# Altium project controller.PrjPcb
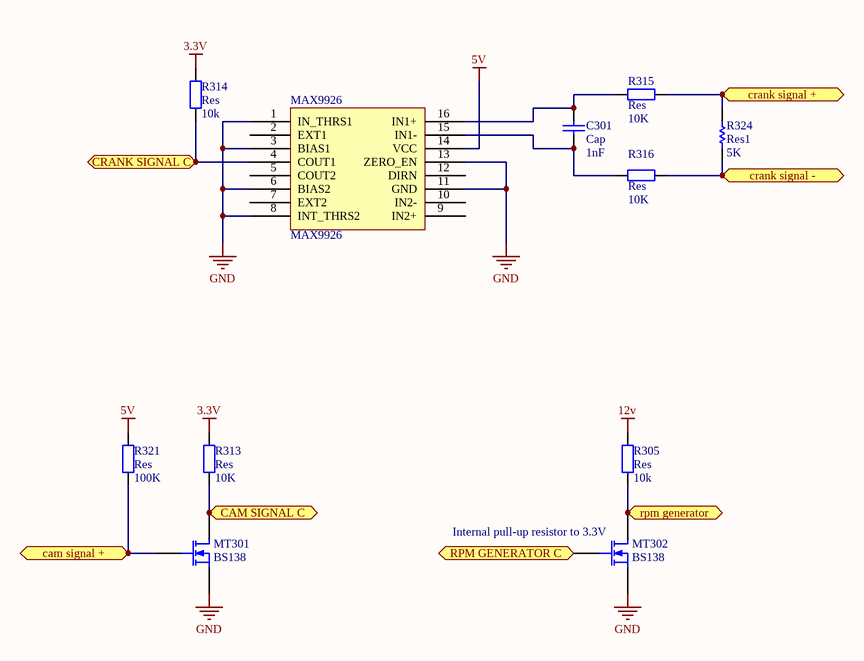
[diagram p0: tach.SchDoc]
7 sheets, 105 parts. Net scope: global (net labels, ports and power ports of the same name join across sheets).
Board file: controller.PcbDoc
Sheets:
  tach.SchDoc
  controller.SchDoc
  power.SchDoc
  ignition.SchDoc
  connectors.SchDoc
  analogSignals.SchDoc
  injectors.SchDoc

## Sheet tach.SchDoc
size A4

### Parts
C301  Cap  value 1nF  [1206 footprint]
MAX9926  MAX9926  [TSSOP-16]
MT301  BS138  [SOT23]
MT302  BS138  [SOT23]
R305  Res  value 10k  [1206 footprint]
R313  Res  value 10K  [1206 footprint]
R314  Res  value 10k  [1206 footprint]
R315  Res  value 10K  [1206 footprint]
R316  Res  value 10K  [1206 footprint]
R321  Res  value 100K  [1206 footprint]
R324  Res1  value 5K  [AXIAL-0.3]

### Ports
cam signal + (bidir), CAM SIGNAL C (bidir), crank signal + (bidir), crank signal - (bidir), CRANK SIGNAL C (bidir), rpm generator (bidir), RPM GENERATOR C (bidir)

### Nets
3.3V: R313.2 R314.2
5V: MAX9926.14(VCC) R321.2
12V: R305.2
GND: MAX9926.1(IN_THRS1) MAX9926.3(BIAS1) MAX9926.6(BIAS2) MAX9926.8(INT_THRS2) MAX9926.11(GND) MAX9926.13(ZERO_EN) MT301.2(S) MT302.2(S)
NetArduino_Due_Core_54: MAX9926.4(COUT1) R314.1 ; port CRANK SIGNAL C
NetArduino_Due_Core_58: MT301.3(D) R313.1 ; port CAM SIGNAL C
NetArduino_Due_Core_91: MT302.1(G) ; port RPM GENERATOR C
NetATX*_4: R315.2 R324.2 ; port crank signal +
NetATX*_5: MT301.1(G) R321.1 ; port cam signal +
NetATX*_16: R316.2 R324.1 ; port crank signal -
NetATX*_17: MT302.3(D) R305.1 ; port rpm generator
NetC301_1: C301.1 MAX9926.15(IN1-) R316.1
NetC301_2: C301.2 MAX9926.16(IN1+) R315.1

Not connected (* = marked no-connect by the designer): MAX9926 2(EXT1) 5(COUT2) 7(EXT2) 9(IN2+) 10(IN2-) 12(DIRN)

### Notes on the sheet
- (near MT302) Internal pull-up resistor to 3.3V

### Library data of the parts
R324 = Res1: Resistor; Published: 8-Jun-2000; LatestRevisionDate: 17-Jul-2002; LatestRevisionNote: Re-released for DXP Platform.; PackageReference: AXIAL-0.3; Publisher: Altium Limited; PackageDescription: Axial Device, Thru-Hole; 2 Leads; 0.3 in Pin Spacing

## Sheet controller.SchDoc
size A4
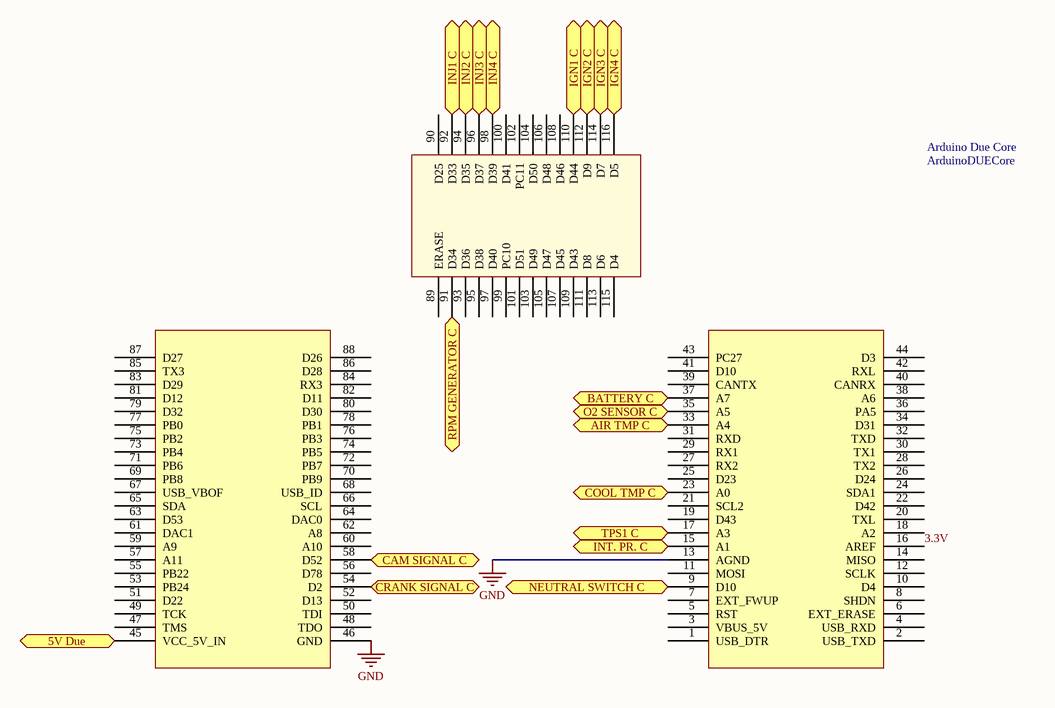
[diagram p1: controller.SchDoc]

### Parts
Arduino_Due_Core  ArduinoDUECore  [ARDUINO DUE CORE]

### Ports
5V Due (bidir), AIR TMP C (bidir), BATTERY C (bidir), CAM SIGNAL C (bidir), COOL TMP C (bidir), CRANK SIGNAL C (bidir), IGN1 C (bidir), IGN2 C (bidir), IGN3 C (bidir), IGN4 C (bidir), INJ1 C (bidir), INJ2 C (bidir), INJ3 C (bidir), INJ4 C (bidir), INT. PR. C (bidir), NEUTRAL SWITCH C (bidir), O2 SENSOR C (bidir), RPM GENERATOR C (bidir), TPS1 C (bidir)

### Nets
3.3V: Arduino_Due_Core.16(AREF)
GND: Arduino_Due_Core.13(AGND) Arduino_Due_Core.46(GND)
NetArduino_Due_Core_9: Arduino_Due_Core.9(D10) ; port NEUTRAL SWITCH C
NetArduino_Due_Core_15: Arduino_Due_Core.15(A1) ; port INT. PR. C
NetArduino_Due_Core_17: Arduino_Due_Core.17(A3) ; port TPS1 C
NetArduino_Due_Core_23: Arduino_Due_Core.23(A0) ; port COOL TMP C
NetArduino_Due_Core_33: Arduino_Due_Core.33(A4) ; port AIR TMP C
NetArduino_Due_Core_35: Arduino_Due_Core.35(A5) ; port O2 SENSOR C
NetArduino_Due_Core_37: Arduino_Due_Core.37(A7) ; port BATTERY C
NetArduino_Due_Core_45: Arduino_Due_Core.45(VCC_5V_IN) ; port 5V Due
NetArduino_Due_Core_54: Arduino_Due_Core.54(D2) ; port CRANK SIGNAL C
NetArduino_Due_Core_58: Arduino_Due_Core.58(D52) ; port CAM SIGNAL C
NetArduino_Due_Core_91: Arduino_Due_Core.91(D34) ; port RPM GENERATOR C
NetArduino_Due_Core_92: Arduino_Due_Core.92(D33) ; port INJ1 C
NetArduino_Due_Core_94: Arduino_Due_Core.94(D35) ; port INJ2 C
NetArduino_Due_Core_96: Arduino_Due_Core.96(D37) ; port INJ3 C
NetArduino_Due_Core_98: Arduino_Due_Core.98(D39) ; port INJ4 C
NetArduino_Due_Core_110: Arduino_Due_Core.110(D44) ; port IGN1 C
NetArduino_Due_Core_112: Arduino_Due_Core.112(D9) ; port IGN2 C
NetArduino_Due_Core_114: Arduino_Due_Core.114(D7) ; port IGN3 C
NetArduino_Due_Core_116: Arduino_Due_Core.116(D5) ; port IGN4 C

Not connected (* = marked no-connect by the designer): Arduino_Due_Core 1(USB_DTR) 2(USB_TXD) 3(VBUS_5V) 4(USB_RXD) 5(RST) 6(EXT_ERASE) 7(EXT_FWUP) 8(SHDN) 10(D4) 11(MOSI) 12(SCLK) 14(MISO) 18(A2) 19(D43) 20(TXL) 21(SCL2) 22(D42) 24(SDA1) 25(D23) 26(D24) 27(RX2) 28(TX2) 29(RX1) 30(TX1) 31(RXD) 32(TXD) 34(D31) 36(PA5) 38(A6) 39(CANTX) 40(CANRX) 41(D10) 42(RXL) 43(PC27) 44(D3) 47(TMS) 48(TDO) 49(TCK) 50(TDI) 51(D22) 52(D13) 53(PB24) 55(PB22) 56(D78) 57(A11) 59(A9) 60(A10) 61(DAC1) 62(A8) 63(D53) 64(DAC0) 65(SDA) 66(SCL) 67(USB_VBOF) 68(USB_ID) 69(PB8) 70(PB9) 71(PB6) 72(PB7) 73(PB4) 74(PB5) 75(PB2) 76(PB3) 77(PB0) 78(PB1) 79(D32) 80(D30) 81(D12) 82(D11) 83(D29) 84(RX3) 85(TX3) 86(D28) 87(D27) 88(D26) 89(ERASE) 90(D25) 93(D36) 95(D38) 97(D40) 99(PC10) 100(D41) 101(D51) 102(PC11) 103(D49) 104(D50) 105(D47) 106(D48) 107(D45) 108(D46) 109(D43) 111(D8) 113(D6) 115(D4)

## Sheet power.SchDoc
size A4
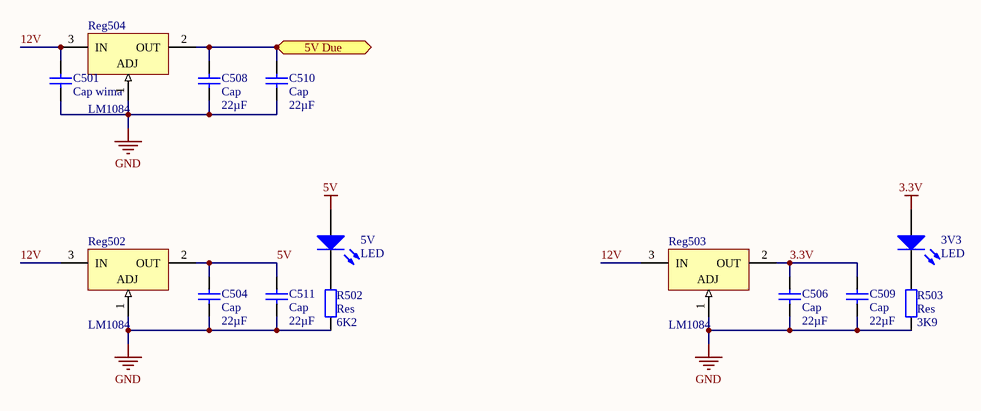
[diagram p2: power.SchDoc]

### Parts
3V3  LED  [LED 3mm]
5V  LED  [LED 3mm]
C501  Cap wima  [Wima 11x16x7.2mm]
C504  Cap  value 22µF  [1206 footprint]
C506  Cap  value 22µF  [1206 footprint]
C508  Cap  value 22µF  [1206 footprint]
C509  Cap  value 22µF  [1206 footprint]
C510  Cap  value 22µF  [1206 footprint]
C511  Cap  value 22µF  [1206 footprint]
R502  Res  value 6K2  [1206 footprint]
R503  Res  value 3K9  [1206 footprint]
Reg502  LM1084  [LM1084]
Reg503  LM1084  [LM1084]
Reg504  LM1084  [LM1084]

### Ports
5V Due (bidir)

### Nets
3.3V: 3V3.1(A) C506.2 C509.2 Reg503.2(OUT)
5V: 5V.1(A) C504.2 C511.2 Reg502.2(OUT)
12V: C501.2 Reg502.3(IN) Reg503.3(IN) Reg504.3(IN)
GND: C501.1 C504.1 C506.1 C508.1 C509.1 C510.1 C511.1 R502.1 R503.1 Reg502.1(ADJ) Reg503.1(ADJ) Reg504.1(ADJ)
Net3V3_2: 3V3.2(K) R503.2
Net5V_2: 5V.2(K) R502.2
NetArduino_Due_Core_45: C508.2 C510.2 Reg504.2(OUT) ; port 5V Due

## Sheet ignition.SchDoc
size A4
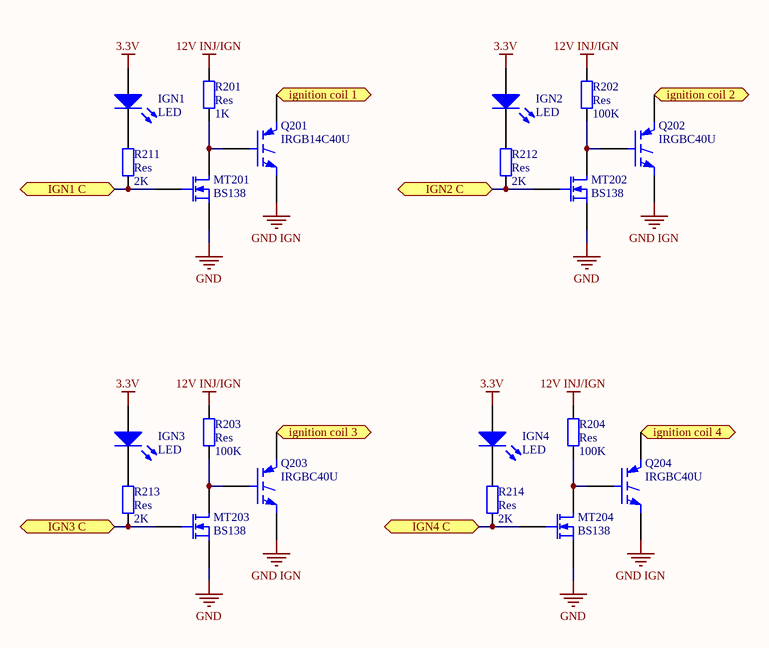
[diagram p3: ignition.SchDoc]

### Parts
IGN1  LED  [LED 3mm]
IGN2  LED  [LED 3mm]
IGN3  LED  [LED 3mm]
IGN4  LED  [LED 3mm]
MT201  BS138  [SOT23]
MT202  BS138  [SOT23]
MT203  BS138  [SOT23]
MT204  BS138  [SOT23]
Q201  IRGB14C40U  [TO-220AB]
Q202  IRGBC40U  [TO-220AB]
Q203  IRGBC40U  [TO-220AB]
Q204  IRGBC40U  [TO-220AB]
R201  Res  value 1K  [1206 footprint]
R202  Res  value 100K  [1206 footprint]
R203  Res  value 100K  [1206 footprint]
R204  Res  value 100K  [1206 footprint]
R211  Res  value 2K  [1206 footprint]
R212  Res  value 2K  [1206 footprint]
R213  Res  value 2K  [1206 footprint]
R214  Res  value 2K  [1206 footprint]

### Ports
IGN1 C (bidir), IGN2 C (bidir), IGN3 C (bidir), IGN4 C (bidir), ignition coil 1 (bidir), ignition coil 2 (bidir), ignition coil 3 (bidir), ignition coil 4 (bidir)

### Nets
3.3V: IGN1.1(A) IGN2.1(A) IGN3.1(A) IGN4.1(A)
12V INJ/IGN: R201.2 R202.2 R203.2 R204.2
GND: MT201.2(S) MT202.2(S) MT203.2(S) MT204.2(S)
GND IGN: Q201.3(E) Q202.3(E) Q203.3(E) Q204.3(E)
NetArduino_Due_Core_110: MT201.1(G) R211.1 ; port IGN1 C
NetArduino_Due_Core_112: MT202.1(G) R212.1 ; port IGN2 C
NetArduino_Due_Core_114: MT203.1(G) R213.1 ; port IGN3 C
NetArduino_Due_Core_116: MT204.1(G) R214.1 ; port IGN4 C
NetATX*_11: Q204.2(C) ; port ignition coil 4
NetATX*_12: Q203.2(C) ; port ignition coil 3
NetATX*_23: Q201.2(C) ; port ignition coil 1
NetATX*_24: Q202.2(C) ; port ignition coil 2
NetIGN1_2: IGN1.2(K) R211.2
NetIGN2_2: IGN2.2(K) R212.2
NetIGN3_2: IGN3.2(K) R213.2
NetIGN4_2: IGN4.2(K) R214.2
NetMT201_3: MT201.3(D) Q201.1(G) R201.1
NetMT202_3: MT202.3(D) Q202.1(G) R202.1
NetMT203_3: MT203.3(D) Q203.1(G) R203.1
NetMT204_3: MT204.3(D) Q204.1(G) R204.1

### Library data of the parts
Q201-Q204 = IRGBC40U: Insulated Gate Bipolar Transistor; Note: Pin 2 (collector) is electrically connected to the TAB; Published: 8-Jun-2000; LatestRevisionDate: 17-Sep-2003; LatestRevisionNote: SIM Port Mapping Fixed.; DatasheetVersion: PD-9.683A; PackageVersion: Feb-1997; PackageReference: TO-220AB; Publisher: Altium Limited; PackageDescription: TO, Thru-Hole, Vertical, Heatsink Mounted; 3 In-Line Leads; Pitch 2.54 mm; ComponentLink1Description: Manufacturer Link; ComponentLink1URL: http://www.irf.com/

## Sheet connectors.SchDoc
size A4; PageSetup: Record=PageOptions|CenterHorizontal=True|CenterVertical=True|PrintScale=1.00|XCorrection=1.00|YCorrection=1.00|PrintKind=1|BorderSize=5000000|LeftOffset=0|BottomOffset=0|Orientation=2|PaperLength=1000|PaperWidth=1000|Scale=100|PaperSource=7|PrintQuality=600|MediaType=1|DitherType=10|PrintScaleMode=1|PaperKind=A4|PaperIndex=9
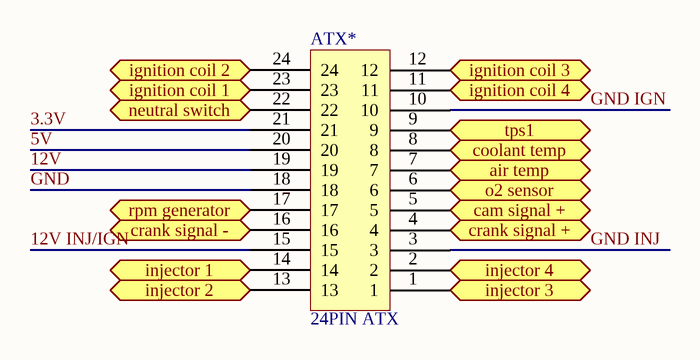
[diagram p4: connectors.SchDoc]

### Parts
ATX*  24PIN ATX  [24 PIN ATX]

### Ports
air temp (bidir), cam signal + (bidir), coolant temp (bidir), crank signal + (bidir), crank signal - (bidir), ignition coil 1 (bidir), ignition coil 2 (bidir), ignition coil 3 (bidir), ignition coil 4 (bidir), injector 1 (bidir), injector 2 (bidir), injector 3 (bidir), injector 4 (bidir), neutral switch (bidir), o2 sensor (bidir), rpm generator (bidir), tps1 (bidir)

### Nets
3.3V: ATX*.21
5V: ATX*.20
12V: ATX*.19
12V INJ/IGN: ATX*.15
GND: ATX*.18
GND IGN: ATX*.10
GND INJ: ATX*.3
NetArduino_Due_Core_9: ATX*.22 ; port neutral switch
NetATX*_1: ATX*.1 ; port injector 3
NetATX*_2: ATX*.2 ; port injector 4
NetATX*_4: ATX*.4 ; port crank signal +
NetATX*_5: ATX*.5 ; port cam signal +
NetATX*_6: ATX*.6 ; port o2 sensor
NetATX*_7: ATX*.7 ; port air temp
NetATX*_8: ATX*.8 ; port coolant temp
NetATX*_9: ATX*.9 ; port tps1
NetATX*_11: ATX*.11 ; port ignition coil 4
NetATX*_12: ATX*.12 ; port ignition coil 3
NetATX*_13: ATX*.13 ; port injector 2
NetATX*_14: ATX*.14 ; port injector 1
NetATX*_16: ATX*.16 ; port crank signal -
NetATX*_17: ATX*.17 ; port rpm generator
NetATX*_23: ATX*.23 ; port ignition coil 1
NetATX*_24: ATX*.24 ; port ignition coil 2

## Sheet analogSignals.SchDoc
size A4
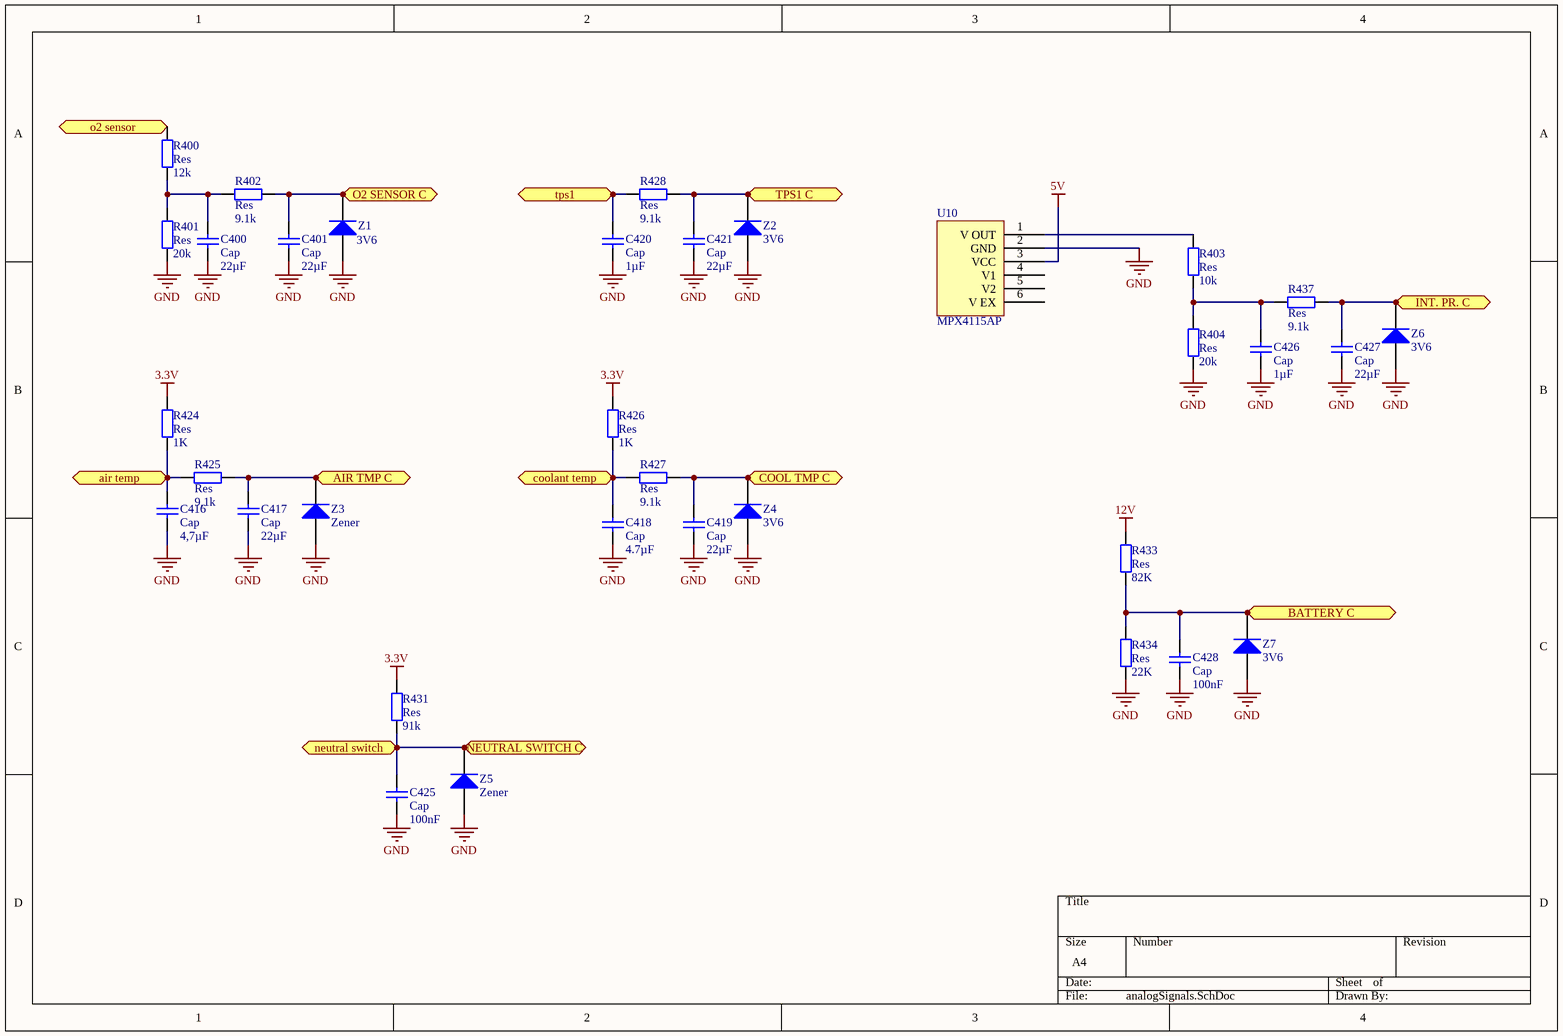
[diagram p5: analogSignals.SchDoc]

### Parts
C400  Cap  value 22µF  [1206 footprint]
C401  Cap  value 22µF  [1206 footprint]
C416  Cap  value 4,7µF  [1206 footprint]
C417  Cap  value 22µF  [1206 footprint]
C418  Cap  value 4.7µF  [1206 footprint]
C419  Cap  value 22µF  [1206 footprint]
C420  Cap  value 1µF  [1206 footprint]
C421  Cap  value 22µF  [1206 footprint]
C425  Cap  value 100nF  [1206 footprint]
C426  Cap  value 1µF  [1206 footprint]
C427  Cap  value 22µF  [1206 footprint]
C428  Cap  value 100nF  [1206 footprint]
R400  Res  value 12k  [1206 footprint]
R401  Res  value 20k  [1206 footprint]
R402  Res  value 9.1k  [1206 footprint]
R403  Res  value 10k  [1206 footprint]
R404  Res  value 20k  [1206 footprint]
R424  Res  value 1K  [1206 footprint]
R425  Res  value 9,1k  [1206 footprint]
R426  Res  value 1K  [1206 footprint]
R427  Res  value 9.1k  [1206 footprint]
R428  Res  value 9.1k  [1206 footprint]
R431  Res  value 91k  [1206 footprint]
R433  Res  value 82K  [1206 footprint]
R434  Res  value 22K  [1206 footprint]
R437  Res  value 9.1k  [1206 footprint]
U10  MPX4115AP  [MPX4115AP]
Z1  3V6  [SOD-80]
Z2  3V6  [SOD-80]
Z3  Zener  [SOD-80]
Z4  3V6  [SOD-80]
Z5  Zener  [SOD-80]
Z6  3V6  [SOD-80]
Z7  3V6  [SOD-80]

### Ports
air temp (bidir), AIR TMP C (bidir), BATTERY C (bidir), COOL TMP C (bidir), coolant temp (bidir), INT. PR. C (bidir), neutral switch (bidir), NEUTRAL SWITCH C (bidir), o2 sensor (bidir), O2 SENSOR C (bidir), tps1 (bidir), TPS1 C (bidir)

### Nets
3.3V: R424.2 R426.2 R431.2
5V: U10.3(VCC)
12V: R433.2
GND: C400.1 C401.1 C416.1 C417.1 C418.1 C419.1 C420.1 C421.1 C425.1 C426.1 C427.1 C428.1 R401.1 R404.1 R434.1 U10.2(GND) Z1.1(A) Z2.1(A) Z3.1(A) Z4.1(A) Z5.1(A) Z6.1(A) Z7.1(A)
NetArduino_Due_Core_9: C425.2 R431.1 Z5.2(K) ; port neutral switch, port NEUTRAL SWITCH C
NetArduino_Due_Core_15: C427.2 R437.2 Z6.2(K) ; port INT. PR. C
NetArduino_Due_Core_17: C421.2 R428.2 Z2.2(K) ; port TPS1 C
NetArduino_Due_Core_23: C419.2 R427.2 Z4.2(K) ; port COOL TMP C
NetArduino_Due_Core_33: C417.2 R425.2 Z3.2(K) ; port AIR TMP C
NetArduino_Due_Core_35: C401.2 R402.2 Z1.2(K) ; port O2 SENSOR C
NetArduino_Due_Core_37: C428.2 R433.1 R434.2 Z7.2(K) ; port BATTERY C
NetATX*_6: R400.2 ; port o2 sensor
NetATX*_7: C416.2 R424.1 R425.1 ; port air temp
NetATX*_8: C418.2 R426.1 R427.1 ; port coolant temp
NetATX*_9: C420.2 R428.1 ; port tps1
NetC400_2: C400.2 R400.1 R401.2 R402.1
NetC426_2: C426.2 R403.1 R404.2 R437.1
NetR403_2: R403.2 U10.1(V_OUT)

Not connected (* = marked no-connect by the designer): U10 4(V1) 5(V2) 6(V_EX)

### Library data of the parts
Z1-Z7 = TZM

## Sheet injectors.SchDoc
size A4
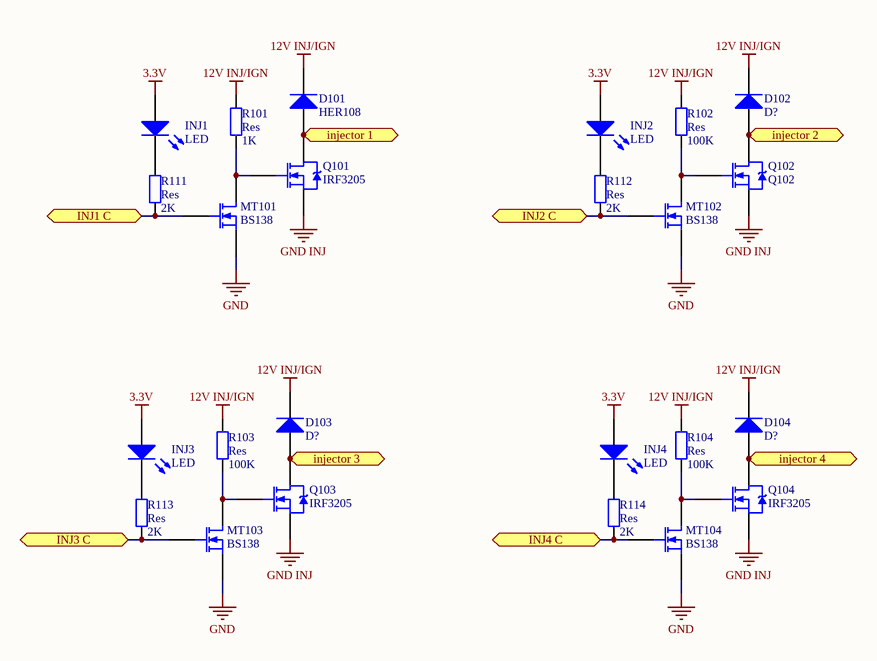
[diagram p6: injectors.SchDoc]

### Parts
D101  HER108  [1N4007]
D102  D?  [1N4007]
D103  D?  [1N4007]
D104  D?  [1N4007]
INJ1  LED  [LED 3mm]
INJ2  LED  [LED 3mm]
INJ3  LED  [LED 3mm]
INJ4  LED  [LED 3mm]
MT101  BS138  [SOT23]
MT102  BS138  [SOT23]
MT103  BS138  [SOT23]
MT104  BS138  [SOT23]
Q101  IRF3205  [TO-220AB]
Q102  Q102  [TO-220AB]
Q103  IRF3205  [TO-220AB]
Q104  IRF3205  [TO-220AB]
R101  Res  value 1K  [1206 footprint]
R102  Res  value 100K  [1206 footprint]
R103  Res  value 100K  [1206 footprint]
R104  Res  value 100K  [1206 footprint]
R111  Res  value 2K  [1206 footprint]
R112  Res  value 2K  [1206 footprint]
R113  Res  value 2K  [1206 footprint]
R114  Res  value 2K  [1206 footprint]

### Ports
INJ1 C (bidir), INJ2 C (bidir), INJ3 C (bidir), INJ4 C (bidir), injector 1 (bidir), injector 2 (bidir), injector 3 (bidir), injector 4 (bidir)

### Nets
3.3V: INJ1.1(A) INJ2.1(A) INJ3.1(A) INJ4.1(A)
12V INJ/IGN: D101.2(K) D102.2(K) D103.2(K) D104.2(K) R101.2 R102.2 R103.2 R104.2
GND: MT101.2(S) MT102.2(S) MT103.2(S) MT104.2(S)
GND INJ: Q101.3(S) Q102.3(S) Q103.3(S) Q104.3(S)
NetArduino_Due_Core_92: MT101.1(G) R111.1 ; port INJ1 C
NetArduino_Due_Core_94: MT102.1(G) R112.1 ; port INJ2 C
NetArduino_Due_Core_96: MT103.1(G) R113.1 ; port INJ3 C
NetArduino_Due_Core_98: MT104.1(G) R114.1 ; port INJ4 C
NetATX*_1: D103.1(A) Q103.2(D) ; port injector 3
NetATX*_2: D104.1(A) Q104.2(D) ; port injector 4
NetATX*_13: D102.1(A) Q102.2(D) ; port injector 2
NetATX*_14: D101.1(A) Q101.2(D) ; port injector 1
NetINJ1_2: INJ1.2(K) R111.2
NetINJ2_2: INJ2.2(K) R112.2
NetINJ3_2: INJ3.2(K) R113.2
NetINJ4_2: INJ4.2(K) R114.2
NetMT101_3: MT101.3(D) Q101.1(G) R101.1
NetMT102_3: MT102.3(D) Q102.1(G) R102.1
NetMT103_3: MT103.3(D) Q103.1(G) R103.1
NetMT104_3: MT104.3(D) Q104.1(G) R104.1

### Library data of the parts
D101-D104 = 1N4007
Q101-Q104 = IRF3205: HEXFET Power MOSFET; Note: Pin 2 is electrically connected to pin 4.; Published: 8-Jun-2000; LatestRevisionDate: 17-Jul-2002; LatestRevisionNote: Re-released for DXP Platform.; DatasheetVersion: Aug-1997; PackageVersion: Feb-1997; PackageReference: TO-220AB; Publisher: Altium Limited; PackageDescription: TO, Thru-Hole, Vertical, Heatsink Mounted; 3 In-Line Leads; Pitch 2.54 mm; ComponentLink1Description: Manufacturer Link; ComponentLink1URL: http://www.irf.com/; ComponentLink2Description: Datasheet; ComponentLink2URL: http://www.irf.com/product-info/datasheets/data/irf3205.pdf

## Nets that join several sheets
3.3V: tach (R313.2 R314.2), controller (Arduino_Due_Core.16), power (3V3.1 C506.2 C509.2 Reg503.2), ignition (IGN1.1 IGN2.1 IGN3.1 IGN4.1), connectors (ATX*.21), analogSignals (R424.2 R426.2 R431.2), injectors (INJ1.1 INJ2.1 INJ3.1 INJ4.1)
5V: tach (MAX9926.14 R321.2), power (5V.1 C504.2 C511.2 Reg502.2), connectors (ATX*.20), analogSignals (U10.3)
12V: tach (R305.2), power (C501.2 Reg502.3 Reg503.3 Reg504.3), connectors (ATX*.19), analogSignals (R433.2)
12V INJ/IGN: ignition (R201.2 R202.2 R203.2 R204.2), connectors (ATX*.15), injectors (8 pins)
GND: tach (8 pins), controller (Arduino_Due_Core.13 Arduino_Due_Core.46), power (12 pins), ignition (MT201.2 MT202.2 MT203.2 MT204.2), connectors (ATX*.18), analogSignals (23 pins), injectors (MT101.2 MT102.2 MT103.2 MT104.2)
GND IGN: ignition (Q201.3 Q202.3 Q203.3 Q204.3), connectors (ATX*.10)
GND INJ: connectors (ATX*.3), injectors (Q101.3 Q102.3 Q103.3 Q104.3)
NetArduino_Due_Core_9: controller (Arduino_Due_Core.9), connectors (ATX*.22), analogSignals (C425.2 R431.1 Z5.2)
NetArduino_Due_Core_15: controller (Arduino_Due_Core.15), analogSignals (C427.2 R437.2 Z6.2)
NetArduino_Due_Core_17: controller (Arduino_Due_Core.17), analogSignals (C421.2 R428.2 Z2.2)
NetArduino_Due_Core_23: controller (Arduino_Due_Core.23), analogSignals (C419.2 R427.2 Z4.2)
NetArduino_Due_Core_33: controller (Arduino_Due_Core.33), analogSignals (C417.2 R425.2 Z3.2)
NetArduino_Due_Core_35: controller (Arduino_Due_Core.35), analogSignals (C401.2 R402.2 Z1.2)
NetArduino_Due_Core_37: controller (Arduino_Due_Core.37), analogSignals (C428.2 R433.1 R434.2 Z7.2)
NetArduino_Due_Core_45: controller (Arduino_Due_Core.45), power (C508.2 C510.2 Reg504.2)
NetArduino_Due_Core_54: tach (MAX9926.4 R314.1), controller (Arduino_Due_Core.54)
NetArduino_Due_Core_58: tach (MT301.3 R313.1), controller (Arduino_Due_Core.58)
NetArduino_Due_Core_91: tach (MT302.1), controller (Arduino_Due_Core.91)
NetArduino_Due_Core_92: controller (Arduino_Due_Core.92), injectors (MT101.1 R111.1)
NetArduino_Due_Core_94: controller (Arduino_Due_Core.94), injectors (MT102.1 R112.1)
NetArduino_Due_Core_96: controller (Arduino_Due_Core.96), injectors (MT103.1 R113.1)
NetArduino_Due_Core_98: controller (Arduino_Due_Core.98), injectors (MT104.1 R114.1)
NetArduino_Due_Core_110: controller (Arduino_Due_Core.110), ignition (MT201.1 R211.1)
NetArduino_Due_Core_112: controller (Arduino_Due_Core.112), ignition (MT202.1 R212.1)
NetArduino_Due_Core_114: controller (Arduino_Due_Core.114), ignition (MT203.1 R213.1)
NetArduino_Due_Core_116: controller (Arduino_Due_Core.116), ignition (MT204.1 R214.1)
NetATX*_1: connectors (ATX*.1), injectors (D103.1 Q103.2)
NetATX*_2: connectors (ATX*.2), injectors (D104.1 Q104.2)
NetATX*_4: tach (R315.2 R324.2), connectors (ATX*.4)
NetATX*_5: tach (MT301.1 R321.1), connectors (ATX*.5)
NetATX*_6: connectors (ATX*.6), analogSignals (R400.2)
NetATX*_7: connectors (ATX*.7), analogSignals (C416.2 R424.1 R425.1)
NetATX*_8: connectors (ATX*.8), analogSignals (C418.2 R426.1 R427.1)
NetATX*_9: connectors (ATX*.9), analogSignals (C420.2 R428.1)
NetATX*_11: ignition (Q204.2), connectors (ATX*.11)
NetATX*_12: ignition (Q203.2), connectors (ATX*.12)
NetATX*_13: connectors (ATX*.13), injectors (D102.1 Q102.2)
NetATX*_14: connectors (ATX*.14), injectors (D101.1 Q101.2)
NetATX*_16: tach (R316.2 R324.1), connectors (ATX*.16)
NetATX*_17: tach (MT302.3 R305.1), connectors (ATX*.17)
NetATX*_23: ignition (Q201.2), connectors (ATX*.23)
NetATX*_24: ignition (Q202.2), connectors (ATX*.24)